# EAGLE design dcdc (EAGLE 9.6.2)
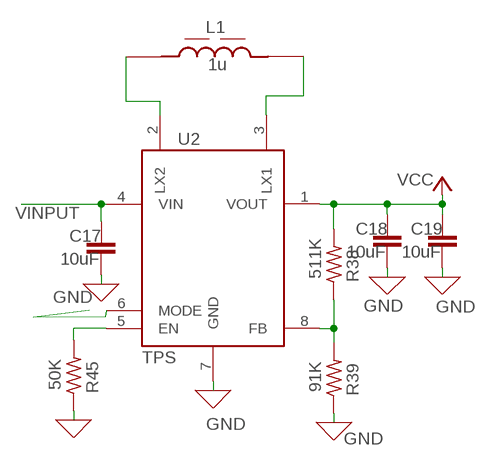
[diagram p0: schematic, sheet 1]

## Parts
C17  10uF  C-EUC0805  [C0805]
C18  10uF  C-EUC0805  [C0805]
C19  10uF  C-EUC0805  [C0805]
L1  1u  5040_INDUCTOR  [IND_74404043220A]
R38  511K  R-US_M0805  [M0805]
R39  91K  R-US_M0805  [M0805]
R45  50K  R-US_M0805  [M0805]
U2  TPS  TPS563212DRLR  [SOTFL50P160X60-8N]

## Nets
GND: C17.2 C18.2 C19.2 R39.1 R45.1 U2.7(GND)
N$20: L1.2 U2.3(LX1)
N$21: L1.1 U2.2(LX2)
N$27: R38.1 R39.2 U2.8(FB)
N$36: R45.2 U2.5(EN)
N$37: U2.6(MODE)
VCC: C18.1 C19.1 R38.2 U2.1(VOUT)
VINPUT: C17.1 U2.4(VIN)

## Library data of the parts
C17-C19 = rcl:C-EU: CAPACITOR, European symbol; SPICEPREFIX: C
L1 = 5040_INDUCTOR:5040_INDUCTOR: WE-LQS SMT Power Inductor Check availability <https://pricing.snapeda.com/parts/74404043220A/Wurth%20Electronics/view-part?ref=eda>; AVAILABILITY: In Stock; CHECK_PRICES: https://www.snapeda.com/parts/74404043220A/Wurth+Electronics+Inc./view-part/?ref=eda; DESCRIPTION: 22 µH Semi-Shielded Wirewound Inductor 1.11 A 200mOhm Nonstandard; MF: Wurth Electronics; MP: 74404043220A; PACKAGE: Nonstandard Würth Elektronik; PRICE: None; PURCHASE-URL: https://www.snapeda.com/api/url_track_click_mouser/?unipart_id=703901&manufacturer=Wurth Electronics&part_name=74404043220A&search_term=744040; SNAPEDA_LINK: https://www.snapeda.com/parts/74404043220A/Wurth+Electronics+Inc./view-part/?ref=snap
R38 R39 R45 = rcl:R-US_: RESISTOR, American symbol; SPICEPREFIX: R
U2 = TPS63000DRLR:TPS563212DRLR: Check availability <https://pricing.snapeda.com/parts/TPS563212DRLR/Texas%20Instruments/view-part?ref=eda>; AVAILABILITY: In Stock; CHECK_PRICES: https://www.snapeda.com/parts/TPS563212DRLR/Texas+Instruments/view-part/?ref=eda; DESCRIPTION: 4.2-V to 18-V, 3-A, 1.2-MHz, synchronous buck converter with eco-mode and selectable FCCM; MF: Texas Instruments; MP: TPS563212DRLR; PACKAGE: SOT-583 Texas Instruments; PRICE: None; PURCHASE-URL: https://www.snapeda.com/api/url_track_click_mouser/?unipart_id=9593796&manufacturer=Texas Instruments&part_name=TPS563212DRLR&search_term=sot-583; SNAPEDA_LINK: https://www.snapeda.com/parts/TPS563212DRLR/Texas+Instruments/view-part/?ref=snap

## Net classes
0 default: width 0.254 mm, clearance 0.254 mm

## Board
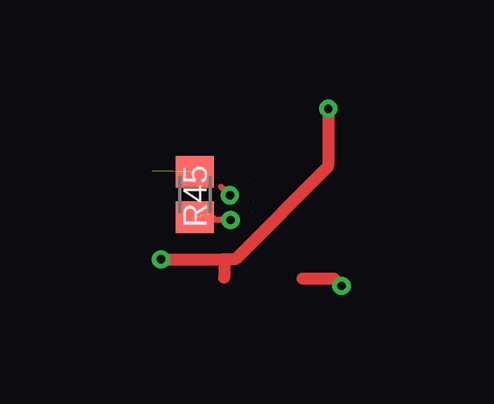
[diagram p1: board, top side]
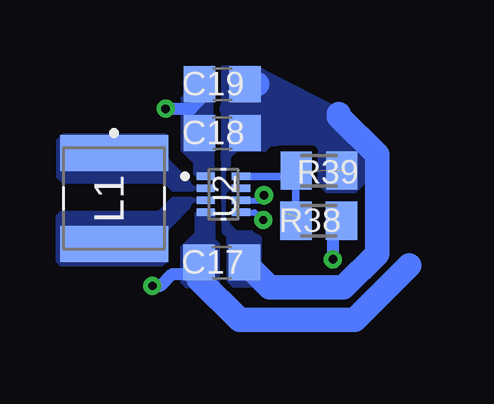
[diagram p2: board, bottom side, seen from below]

No outline drawn. Coordinates in mm, seen from the top.
Copper layers (1*16): Top 0.035mm / dielectric 1.5mm / Bottom 0.035mm
Design rules "default *": minimum track width 8mil, minimum drill 0.35mm, track to track 6mil, track to pad 6mil, pad to pad 6mil, via to via 6mil, smd to smd 6mil, copper to edge 16mil, drill to drill 6mil, minimum pad ring 10mil, minimum via ring 8mil, stop-mask expansion 4mil, vias tented up to drill 0mil, thermal gap 10mil

### Footprints (pad centres in the part's own frame; a part is rotated, then mirrored left to right if it is on the bottom)
C0805 = smd 1.3 x 1.5: 1 -0.95,0; 2 0.95,0
IND_74404043220A = smd 1.5 x 4.5: 1 -1.9,0; 2 1.9,0
M0805 = smd 1.3 x 1.6: 1 -0.95,0; 2 0.95,0
SOTFL50P160X60-8N = smd 0.768 x 0.32: 1 -0.737,0.75; 2 -0.737,0.25; 3 -0.737,-0.25; 4 -0.737,-0.75; 5 0.737,-0.75; 6 0.737,-0.25; 7 0.737,0.25; 8 0.737,0.75

### Placement (x,y rotation side)
C17  35.55,72.73 0 bottom
C18  35.53,78.13 0 bottom
C19  35.53,80.17 0 bottom
L1  40.04,75.41 270 bottom
R38  31.51,74.47 0 bottom
R39  31.5,76.57 180 bottom
R45  32.33,75.57 270 top
U2  35.48,75.58 0 bottom

### Tracks (layer width: path | path; a pad name or v marks a point on that pad's centre or on a via)
GND  (1 unrouted)
  Bottom 1.016: 30.67,78.93 30.67,78.82 29.08,77.23 29.08,73.09 30.48,71.69 33.56,71.69 C17.2 | 34.07,80.17 C19.2
  pour Bottom (isolate 0.2, rank 2, no thermals): 35.21,76.14 35.11,76.02 34.41,76.02 34.34,75.95 34.34,75.7 34.41,75.63 35.07,75.63 35.26,75.44 35.26,74.36 34.93,74.03 34.19,74.03 33.93,73.77 33.93,71.87 34.06,71.74 35.2,71.74 35.3,71.84 35.3,73.45 35.67,73.82 35.67,80.79 35.56,80.9 34.12,80.9 30.95,79.28 29.44,77.77 29.44,76.2 29.96,75.68 31.19,75.68 31.54,76.03 31.54,77.4 31.78,77.64 33.51,77.64 33.74,77.41 34.9,77.41 35.21,77.1
N$20
  pour Bottom (isolate 0.1, no thermals): 35.89,75.24 35.89,75.42 37.61,75.42 38.19,74.84 42.25,74.84 42.42,74.67 42.42,72.77 42.28,72.63 37.95,72.63 37.83,72.75 37.83,74.07 36.67,75.23 35.9,75.23
N$21
  pour Bottom (no thermals): 36.65,75.89 35.88,75.89 35.88,75.73 37.61,75.73 37.95,76.07 42.17,76.07 42.41,76.31 42.41,77.84 42.17,78.08 37.9,78.08 37.83,78.01 37.83,77.07
N$27  (1 unrouted)
  Bottom 0.305: U2.8 32.77,76.33 32.73,76.29 | 32.73,76.29 R39.2 | R38.1 32.46,76.02 32.73,76.29
N$36  (via drill 0.35)  (2 unrouted)
  Top 0.254: v33.82,74.51 33.2,74.51 32.92,74.78
  Bottom 0.254: U2.5 34.18,74.83 33.86,74.51 v33.82,74.51
N$37  (via drill 0.35)  (1 unrouted)
  Top 0.254: v33.79,75.54 v33.78,75.54 33.43,75.89
  Bottom 0.254: U2.6 34,75.33 v33.79,75.54
VCC  (via drill 0.35)
  Top 0.508: v30.92,72.87 33.55,72.87 | 33.55,72.87 34.01,72.87 37.89,76.75 v37.89,79.15 | 33.55,72.87 33.55,72.09
  Bottom 0.508: R38.2 30.92,74.11 v30.92,72.87 | v37.89,79.15 36.82,79.15 36.48,79.49 C19.1
  pour Bottom (isolate 0.2, no thermals): 35.88,76.71 35.88,76.22 35.9,76.2 36.48,76.2 36.7,76.42 36.7,76.88 37.22,77.4 37.22,79.57 37.24,79.59 35.94,80.92 35.94,77.43 35.9,77.39 35.9,76.73
VINPUT  (via drill 0.35)
  Top 0.508: v38.44,71.76 38.13,72.07 36.81,72.07
  Bottom 0.508: v38.44,71.76 38.1,71.76 37.61,72.25 36.5,72.25 C17.1
  Bottom 1.016: C17.1 36.5,72.04 34.81,70.35 30,70.35 27.73,72.62
  pour Bottom (isolate 0.2, no thermals): 35.87,74.92 35.87,73.71 35.68,73.52 35.68,71.87 35.84,71.71 37.05,71.71 37.24,71.9 37.24,73.38 36.64,73.98 36.64,74.77 36.49,74.92